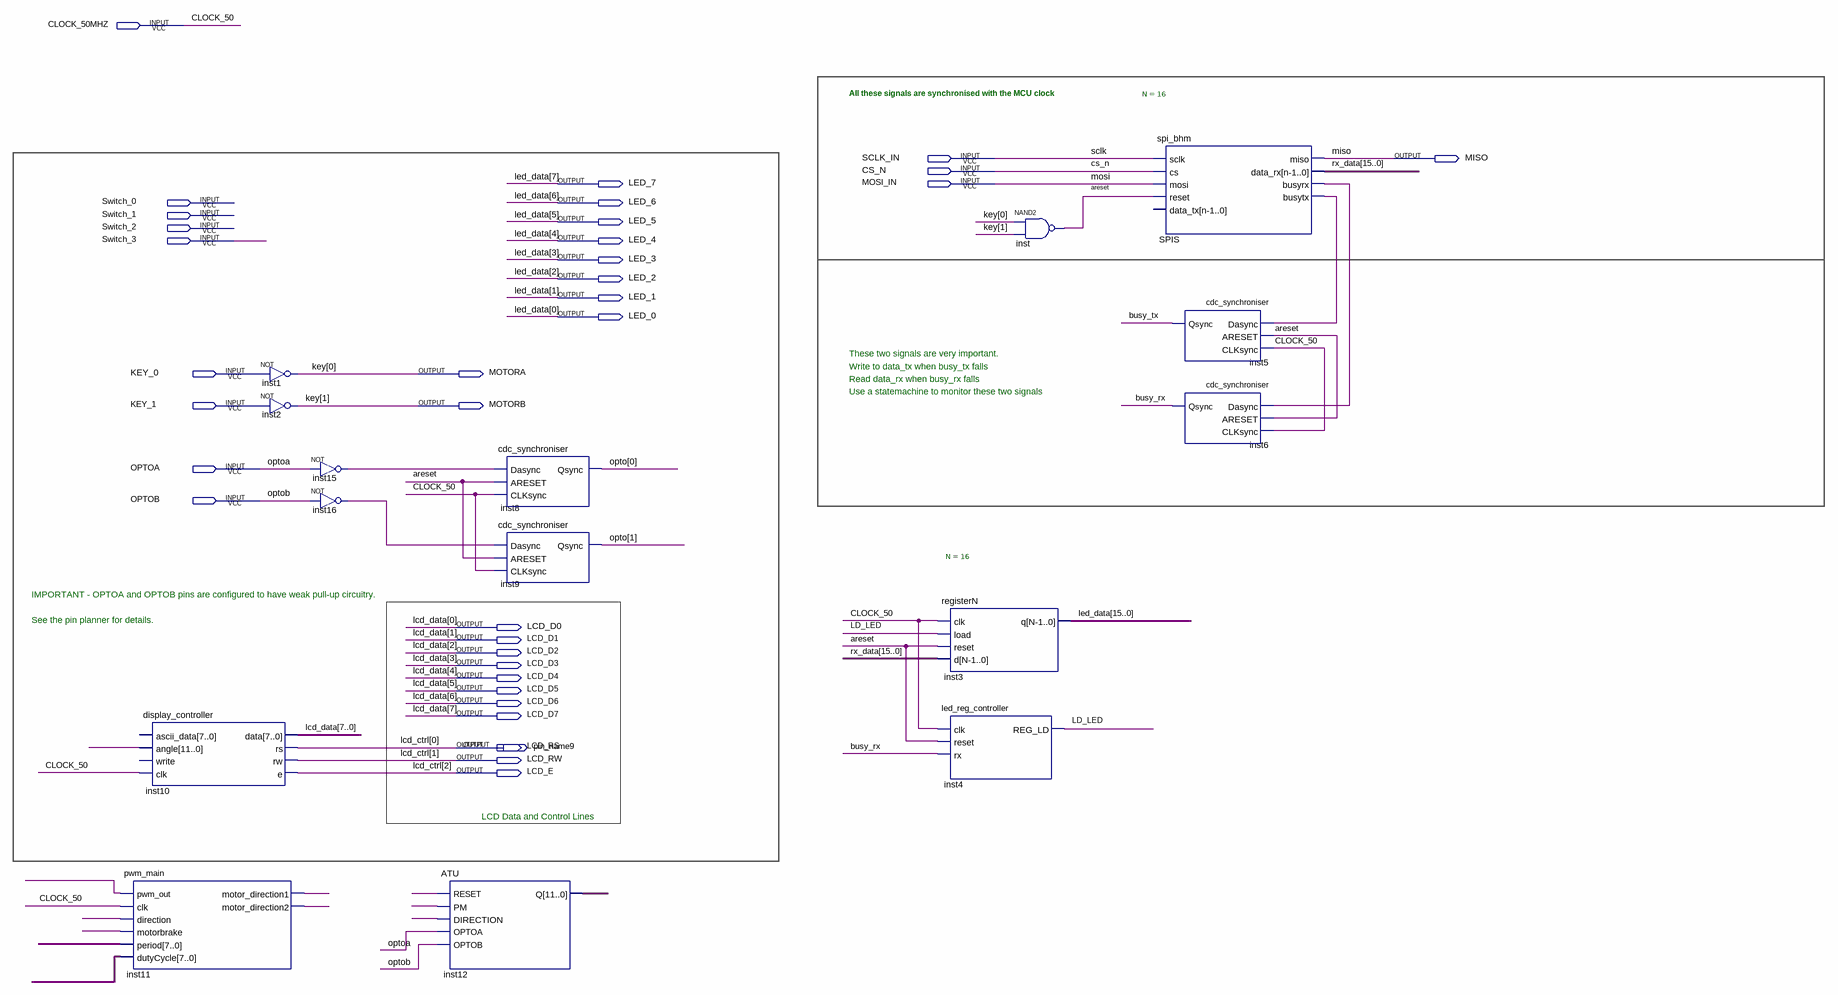
[diagram p0: schematic sheet]
// Quartus schematic spi_test.bdf as structural Verilog: 15 symbols, 35 pins
module spi_test (
  input  CLOCK_50MHZ,
  input  SCLK_IN,
  input  CS_N,
  input  MOSI_IN,
  input  Switch_0,
  input  Switch_1,
  input  Switch_2,
  input  Switch_3,
  input  KEY_0,
  input  KEY_1,
  input  OPTOA,
  input  OPTOB,
  output MISO,
  output LED_7,
  output LED_6,
  output LED_5,
  output LED_4,
  output LED_3,
  output LED_2,
  output LED_1,
  output LED_0,
  output MOTORA,
  output MOTORB,
  output LCD_D0,
  output LCD_D1,
  output LCD_D2,
  output LCD_D3,
  output LCD_D4,
  output LCD_D5,
  output LCD_D6,
  output LCD_D7,
  output LCD_RS,
  output pin_name9,
  output LCD_RW,
  output LCD_E
);

  wire areset, busy_rx, busy_tx, inst11_motor_direction1, inst11_motor_direction2, inst15_out, inst16_out,
       LD_LED, SPIS_busyrx, SPIS_busytx, undriven, undriven_2, undriven_3, undriven_4, undriven_7,
       undriven_8, undriven_9;
  wire [1:0] opto;
  wire [7:0] undriven_5, undriven_6;
  wire [11:0] inst12_q;
  wire [15:0] rx_data;
  wire [15:8] led_data;

  pwm_main inst11 (
    .pwm_out(undriven_4), .clk(CLOCK_50MHZ), .direction(undriven_2), .motorbrake(undriven_3),
    .period(undriven_6), .dutyCycle(undriven_5), .motor_direction1(inst11_motor_direction1),
    .motor_direction2(inst11_motor_direction2));
  display_controller inst10 (
    .angle({12{undriven}}), .clk(CLOCK_50MHZ),
    .data({LCD_D7, LCD_D6, LCD_D5, LCD_D4, LCD_D3, LCD_D2, LCD_D1, LCD_D0}), .rs(LCD_RS), .rw(LCD_RW),
    .e(LCD_E));  // open: ascii_data, write
  not inst1 (MOTORA, KEY_0);
  not inst2 (MOTORB, KEY_1);
  not inst15 (inst15_out, OPTOA);
  not inst16 (inst16_out, OPTOB);
  ATU inst12 (.RESET(undriven_7), .PM(undriven_8), .DIRECTION(undriven_9), .OPTOA(OPTOA), .OPTOB(OPTOB), .Q(inst12_q));
  cdc_synchroniser inst8 (.Dasync(inst15_out), .ARESET(areset), .CLKsync(CLOCK_50MHZ), .Qsync(opto[0]));
  cdc_synchroniser inst9 (.Dasync(inst16_out), .ARESET(areset), .CLKsync(CLOCK_50MHZ), .Qsync(opto[1]));
  registerN #(.N(16)) inst3 (
    .clk(CLOCK_50MHZ), .load(LD_LED), .reset(areset), .d(rx_data),
    .q({led_data, LED_7, LED_6, LED_5, LED_4, LED_3, LED_2, LED_1, LED_0}));
  led_reg_controller inst4 (.clk(CLOCK_50MHZ), .reset(areset), .rx(busy_rx), .REG_LD(LD_LED));
  nand inst (areset, MOTORA, MOTORB);
  spi_bhm #(.N(16)) SPIS (
    .sclk(SCLK_IN), .cs(CS_N), .mosi(MOSI_IN), .reset(areset), .miso(MISO), .data_rx(rx_data),
    .busyrx(SPIS_busyrx), .busytx(SPIS_busytx));  // open: data_tx
  cdc_synchroniser inst5 (.Dasync(SPIS_busytx), .ARESET(areset), .CLKsync(CLOCK_50MHZ), .Qsync(busy_tx));
  cdc_synchroniser inst6 (.Dasync(SPIS_busyrx), .ARESET(areset), .CLKsync(CLOCK_50MHZ), .Qsync(busy_rx));

  // Other names for the same wires on the sheet: CLOCK_50 = CLOCK_50MHZ; key[1:0] = {MOTORB, MOTORA};
  //   lcd_ctrl[2:0] = {LCD_E, LCD_RW, LCD_RS};
  //   lcd_data[7:0] = {LCD_D7, LCD_D6, LCD_D5, LCD_D4, LCD_D3, LCD_D2, LCD_D1, LCD_D0};
  //   led_data[7:0] = {LED_7, LED_6, LED_5, LED_4, LED_3, LED_2, LED_1, LED_0}; mosi = MOSI_IN; sclk = SCLK_IN

  // Notes on the sheet:
  //   All these signals are synchronised with the MCU clock
  //   These two signals are very important.
  //   Write to data_tx when busy_tx falls
  //   Read data_rx when busy_rx falls
  //   Use a statemachine to monitor these two signals
  //   IMPORTANT - OPTOA and OPTOB pins are configured to have weak pull-up circuitry. 
  //   See the pin planner for details.
  //   LCD Data and Control Lines
endmodule
